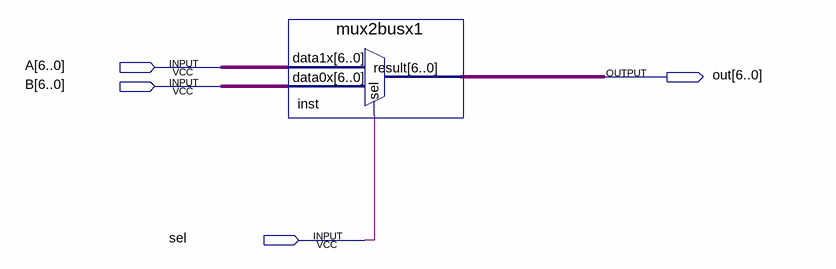
[diagram p0: schematic sheet]
// Quartus schematic testebus.bdf as structural Verilog: 1 symbols, 4 pins
module testebus (
  input  [6:0] A,
  input  [6:0] B,
  input  sel,
  output [6:0] out
);

  mux2busx1 inst (.data1x(A), .data0x(B), .sel(sel), .result(out));
endmodule
